# Altium schematic sheet GNSS.SchDoc
size A4; SheetNumber: 9; SheetTotal: 9
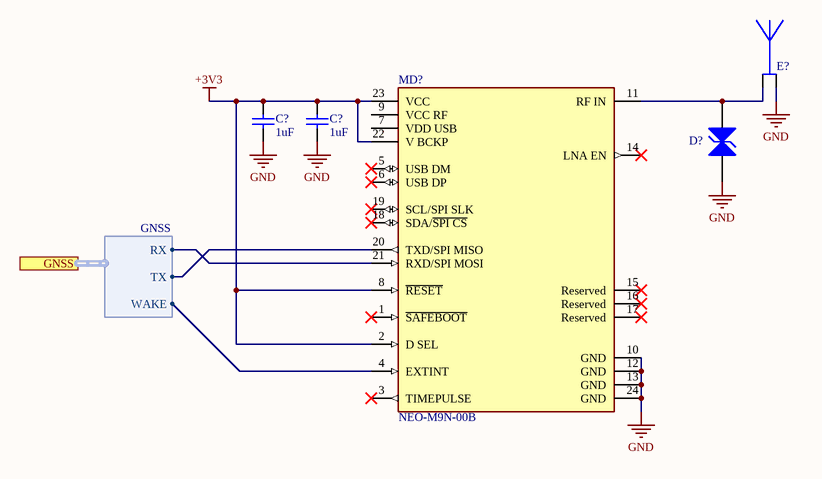
[diagram p0: GNSS.SchDoc]

## Parts
(Parts that share a designator on the sheet are numbered #1, #2 ... from top to bottom, then left to right.)
C?#1  value 1uF  [CAPC1608X10N]  (hidden comment: C0603C105K8PACTU)
C?#2  value 1uF  [CAPC1608X10N]  (hidden comment: C0603C105K8PACTU)
D?  CGA0402MLC-05G  [DIOC1005X04N]  (value not drawn)
E?  SGGP.25.4.A.02  [SGGP.25.4.A.02-Footprint-1]  (value not drawn)
MD?  NEO-M9N-00B  [FP-NEO-M9N-00B-MFG]

## Ports
GNSS (harness GNSS, see Top Level[2B], Microcontroller[1B])

## Harnesses
GNSS: TX, RX, WAKE

## Nets
+3V3: C?#1.2 C?#2.2 MD?.2(D_SEL) MD?.8(~{RESET}) MD?.22(V_BCKP) MD?.23(VCC)
GND: C?#1.1 C?#2.1 D?.1 E?.2(GND) MD?.10(GND) MD?.12(GND) MD?.13(GND) MD?.24(GND)
NetD?_2: D?.2 E?.1(ANT) MD?.11(RF_IN)
NetMD?_4: MD?.4(EXTINT) ; port GNSS.WAKE
NetMD?_20: MD?.20(TXD/SPI_MISO) ; port GNSS.TX
NetMD?_21: MD?.21(RXD/SPI_MOSI) ; port GNSS.RX

Not connected (* = marked no-connect by the designer): MD? 1(~{SAFEBOOT})* 3(TIMEPULSE)* 5(USB_DM)* 6(USB_DP)* 7(VDD_USB) 9(VCC_RF) 14(LNA_EN)* 15(Reserved)* 16(Reserved)* 17(Reserved)* 18(SDA/~{SPI_CS})* 19(SCL/SPI_SLK)*

## Library data of the parts
C?#1 C?#2 = CMP-00045-1: Cap Ceramic 1uF 10V X5R 10% SMD 0603 85°C Paper T/R; Capacitance: 1uF; Voltage Rating (DC): 10V; Case/Package: 0603; Height: 0.8mm; Tolerance: 10%; Width: 0.031inch; Lead Free: Lead Free; Mount: Surface Mount; Length: 1.6mm; Number of Pins: 2; Radiation Hardening: No; Dielectric: X5R; Voltage: 10V; Depth: 0.8mm; Weight: 7.1E-05oz; REACH SVHC: No SVHC; Package Quantity: 1; Max Operating Temperature: 85°C; Case Code (Imperial): 0603; Thickness: 0.035inch; Min Operating Temperature: -55°C; Dielectric Material: Ceramic; Case Code (Metric): 1608; Packaging: Tape and Reel; Voltage Rating: 10V; Termination: SMD/SMT
D? = CMP-00164-1: ESD Suppressor TVS 5V Automotive 2-Pin Case 0402 T/R; Direction: Bidirectional; Number of Circuits: 1; Capacitance: 0.2pF; Clamping Voltage: 30V; Element Configuration: Single; ESD Protection: Yes; Leakage Current: 10nA; Max Reverse Leakage Current: 5nA; Package Quantity: 10000; Operating Supply Voltage: 5V; Max Operating Temperature: 125°C; Max Voltage Rating (DC): 5V; Mount: Surface Mount; Depth: 0.5mm; Length: 1mm; Width: 0.5mm; Voltage Rating (DC): 5V; Number of Pins: 2; Termination: SMD/SMT; Min Operating Temperature: -55°C; REACH SVHC: No SVHC; Case/Package: 0402; Working Voltage: 5V; Radiation Hardening: No; Height: 0.34mm; Packaging: Tape and Reel; Contact Plating: Tin; Case Code (Imperial): 0402; Case Code (Metric): 1005; Current Rating: 5nA
E? = CMP-00032-2: ANTENNA GPS CERAMIC PATCH SMD; Max Frequency: 1.607GHz; Impedance: 50R; Number of Bands: 2; Mount: Surface Mount; Case/Package: SMD/SMT; Package Quantity: 200; Height: 0.177inch; Termination: Solder
MD? = CMP-207130-000006-2: M9 standard precision module; Manufacturer: u-blox; Min Supply Voltage: 1.65V; Sensitivity: -167dBm; Interface: I2C,SPI,UART,USB; Max Supply Voltage: 3.6V; Device Class L3: RF Receivers; Category: UNK; Temperature Range Low: -40°C; Temperature Range High: +85°C; ComponentLink2Description: Datasheet; Manufacturer Part Number: NEO-M9N-00B; ComponentLink2URL: https://www.u-blox.com/sites/default/files/NEO-M9N_DataSheet_%28UBX-19014285%29.pdf; Footprint Url: https://www.u-blox.com/sites/default/files/NEO-M9N_Integrationmanual_%28UBX-19014286%29.pdf; Height: 2.6mm; Automotive: No; RoHS: TRUE; Lead Free: Yes; Octopart: https://octopart.com/neo-m9n-00b-u-blox-107315722; Package: 0; Temperature: -40°C to +85°C; Device Class L1: Integrated Circuits (ICs); Device Class L2: RF Semiconductors and Devices